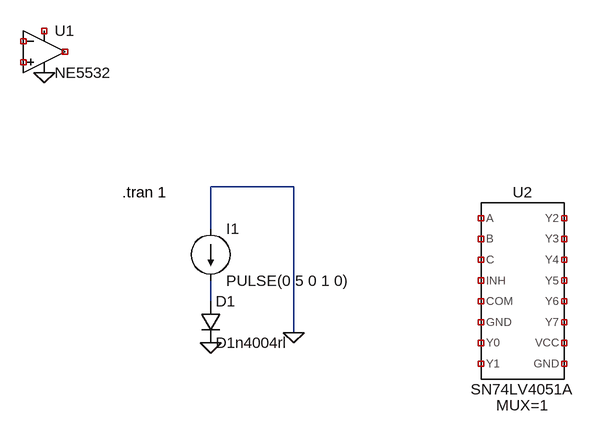
[diagram p0: schematic Import_Example_3.asc]
Import_Example_3.asc, the LTspice schematic file:
Version 4
SHEET 1 2204 4164
WIRE 272 64 144 64
WIRE 144 128 144 64
WIRE 144 240 144 208
WIRE 272 288 272 64
FLAG 144 304 0
FLAG 272 288 0
FLAG -112 -112 0
SYMBOL current 144 128 R0
WINDOW 123 0 0 Left 0
WINDOW 39 0 0 Left 0
SYMATTR InstName I1
SYMATTR Value PULSE(0 5 0 1 0)
SYMBOL diode 128 240 R0
SYMATTR InstName D1
SYMATTR Value D1n4004rl
SYMBOL OpAmps\\opamp2 -112 -208 R0
SYMATTR InstName U1
SYMATTR Value NE5532
SYMBOL SN74LV4051A 624 224 R0
SYMATTR InstName U2
TEXT 8 72 Left 2 !.tran 1

The netlist it stands for:
* Import_Example_3.asc
I1 0 N001 PULSE(0 5 0 1 0)
D1 N001 0 D1n4004rl
XU1 NC_01 NC_02 NC_03 0 NC_04 NE5532  ; pins In+ In- V+ V- OUT
XU2 NC_05 NC_06 NC_07 NC_08 NC_09 NC_10 NC_11 NC_12 NC_13 NC_14 NC_15 NC_16 NC_17 NC_18 NC_19 NC_20 SN74LV4051A MUX=1  ; pins A B C INH COM GND Y0 Y1 Y2 Y3 Y4 Y5 Y6 Y7 VCC GND
.model D D
.lib standard.dio
.tran 1
.lib C:\Users\frisc\Downloads\sclm117\SN74LV4051A.LIB
.backanno
.end